# EAGLE design CSS811_CO2_TVOC_Breakout-Mill (EAGLE 7.5.0)
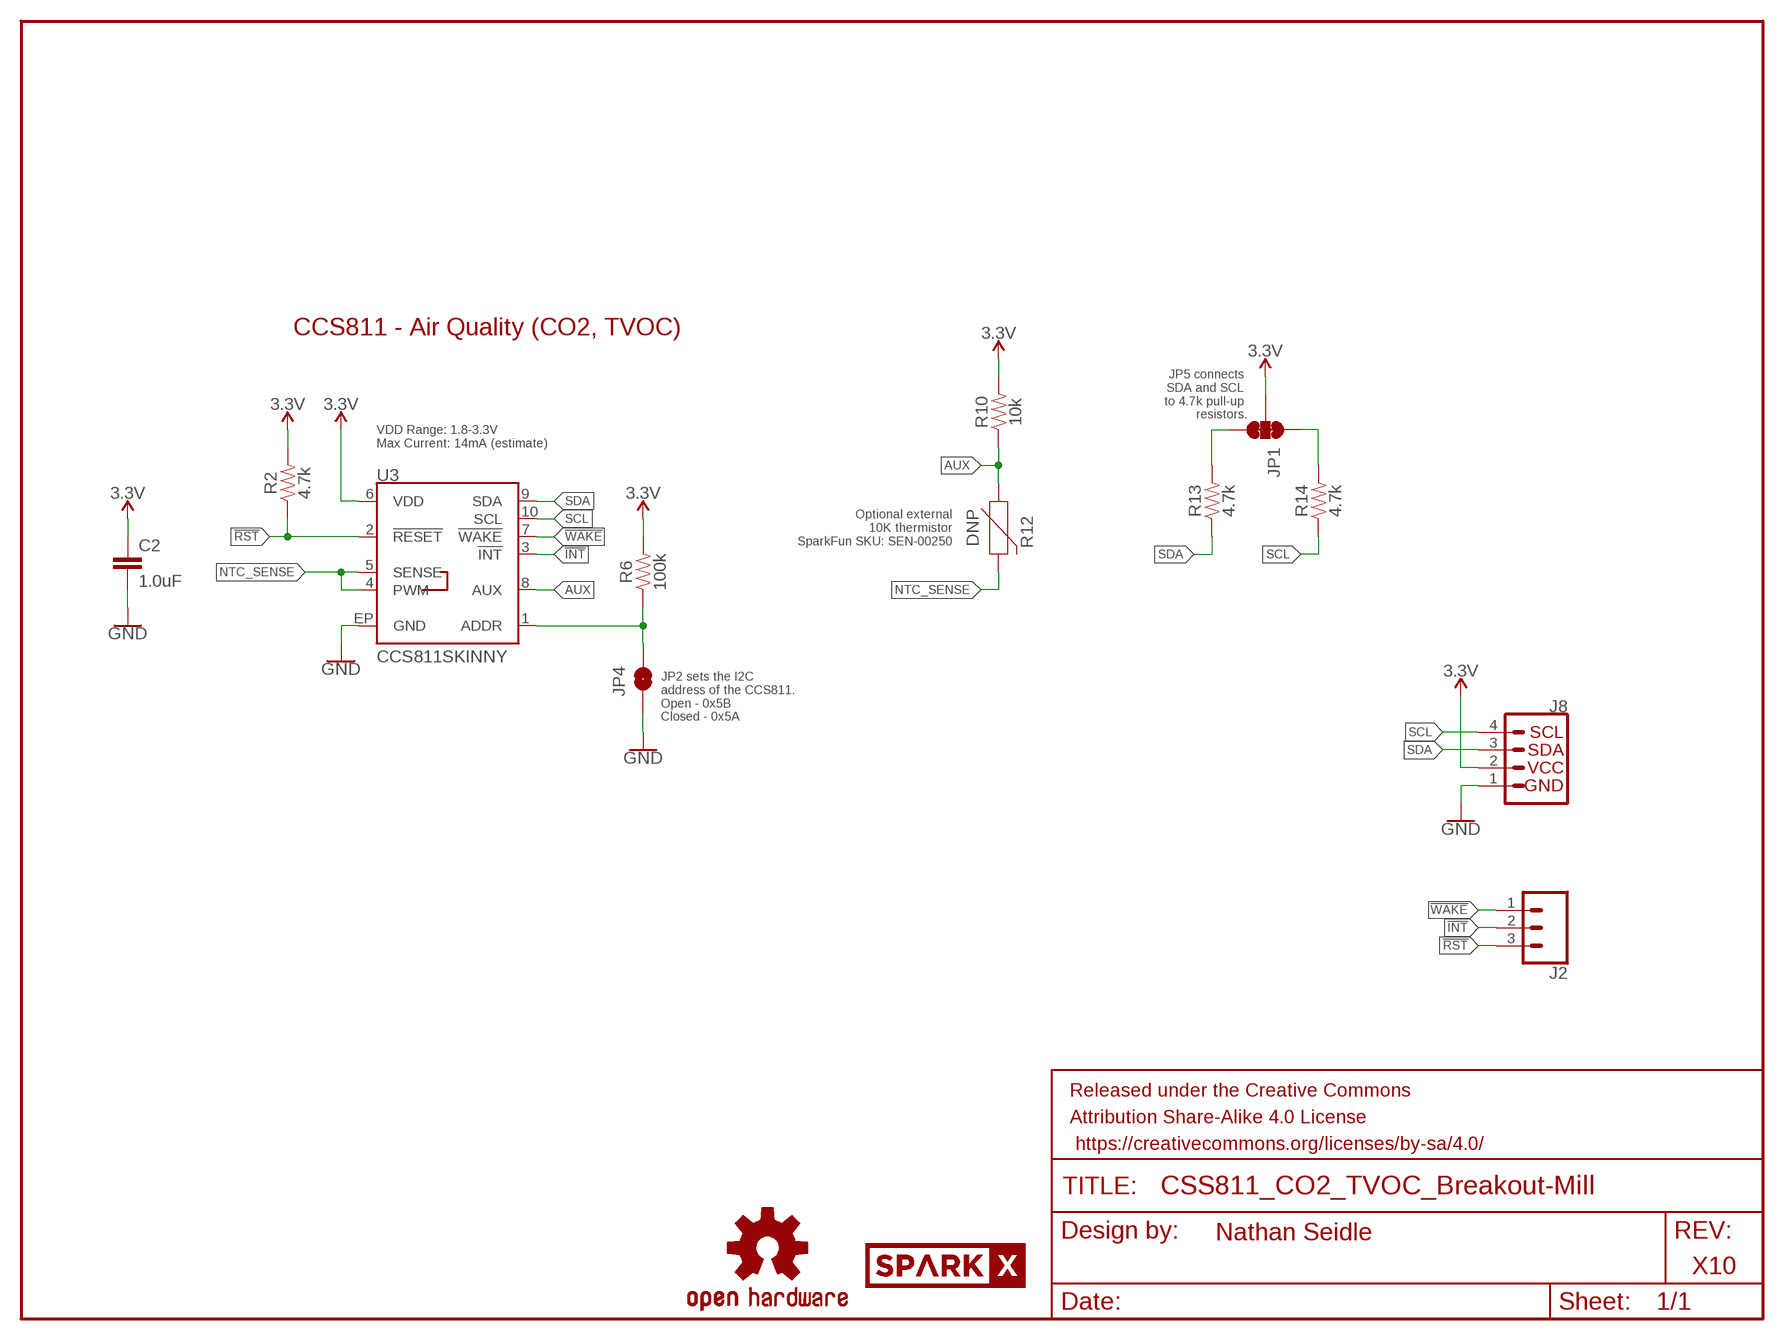
[diagram p0: schematic, sheet 1]

## Parts
C2  1.0uF  1.0UF-0603-16V-10%  [0603]
FRAME1  FRAME-LETTER  [CREATIVE_COMMONS]
J2  CONN_031X03_NO_SILK  [1X03_NO_SILK]
J8  I2C_STANDARD_NO_SILK  [1X04_NO_SILK]
JP1  JUMPER-SMT_3_2-NC_TRACE_SILK  [SMT-JUMPER_3_2-NC_TRACE_SILK]
JP4  JUMPER-SMT_2_NO_SILK  [SMT-JUMPER_2_NO_SILK]
LOGO4  OSHW-LOGOS  [OSHW-LOGO-S]
R2  4.7k  4.7KOHM-0603-1/10W-1%  [0603]
R6  100k  100KOHM-0603-1/10W-1%  [0603]
R10  10k  10KOHM-0603-1/10W-1%  [0603]
R12  DNP  NTC-THERMISTOR-AXIAL-0.1  [AXIAL-0.1]
R13  4.7k  4.7KOHM-0603-1/10W-1%  [0603]
R14  4.7k  4.7KOHM-0603-1/10W-1%  [0603]
U3  CCS811SKINNY  [LGA10-MILLABLE]
U$1  SPARKX-LOGO3  [SPARKX-SMALL]

## Nets
3.3V: C2.1 J8.2 JP1.2 R2.2 R6.2 R10.2 U3.6(VDD)
!INT: J2.2 U3.3(!INT!)
!RST: J2.3 R2.1 U3.2(!RESET!)
!WAKE: J2.1 U3.7(!WAKE!)
AUX: R10.1 R12.P$1 U3.8(AUX)
CCS811_ADDR: JP4.2 R6.1 U3.1(ADDR)
GND: C2.2 J8.1 JP4.1 U3.EP(GND)
N$4: JP1.3 R13.2
N$5: JP1.1 R14.2
NTC_SENSE: R12.P$2 U3.4(PWM) U3.5(SENSE)
SCL: J8.4 R14.1 U3.10(SCL)
SDA: J8.3 R13.1 U3.9(SDA)

## Notes on the sheet
- CCS811 - Air Quality (CO2, TVOC)
- JP5 connects 
  SDA and SCL 
  to 4.7k pull-up 
  resistors.
- VDD Range: 1.8-3.3V
  Max Current: 14mA (estimate)
- Optional external
  10K thermistor
  SparkFun SKU: SEN-00250
- JP2 sets the I2C 
  address of the CCS811.
  Open - 0x5B
  Closed - 0x5A
- Nathan Seidle
- X10

## Library data of the parts
C2 = SparkFun-Capacitors:1.0UF: 1µF ceramic capacitors A capacitor is a passive two-terminal electrical component used to store electrical energy temporarily in an electric field.; PROD_ID: CAP-00868
FRAME1 = SparkFun-Aesthetics:FRAME-LETTER: Schematic Frame - Letter Standard 8.5x11 US Letter frame
J2 = SparkFun-Connectors:CONN_03: Multi connection point. Often used as Generic Header-pin footprint for 0.1 inch spaced/style header connections On any of the 0.1 inch spaced packages, you can populate with these: Break Away Headers - Straight <https://www.sparkfun.com/products/116> (PRT-00116) Break Away Male Headers - Right Angle <https://www.sparkfun.com/products/553> (PRT-00553) Female Headers <https://www.sparkfun.com/products/115> (PRT-00115) Break Away Headers - Machine Pin <https://www.sparkfun.com/products/117> (PRT-00117) Break Away Female Headers - Swiss Machine Pin <https://www.sparkfun.com/products/743> (PRT-00743) Stackable Header - 3 Pin (Female, 0.1") <https://www.sparkfun.com/products/13875> (PRT-13875) For SCREWTERMINALS and SPRING TERMINALS visit here: Screw Terimnals on SparkFun.com <https://www.sparkfun.com/search/results?term=Screw+Terminals> (5mm/3.5mm/2.54mm spacing) This device is also useful as a general connection point to wire up your design to another part of your project. Our various solder wires solder well into these plated through hole pads. Hook-Up Wire - Assortment (Stranded, 22 AWG) <https://www.sparkfun.com/products/11375> (PRT-11375) Hook-Up Wire - Assortment (Solid Core, 22 AWG) <https://www.sparkfun.com/products/11367> (PRT-11367) View the entire wire category on our website here <https://www.sparkfun.com/categories/141> Special notes: Molex polarized connector foot print use with SKU : PRT-08232 with associated crimp pins and housings.
J8 = SparkFun-Connectors:I2C_STANDARD: SparkFun I2C Standard Pinout Header SparkFun has standardized on a pinout for all I2C based sensor breakouts. This pinout allows I2C boards to be plugged directly into the headers on Arduino Uno compatible boards, and to be daisy chained easily. Example SparkFun Products: SparkFun Atmospheric Sensor Breakout - BME280 <https://www.sparkfun.com/products/13676> SparkFun Altitude/Pressure Sensor Breakout - MPL3115A2 <https://www.sparkfun.com/products/11084> SparkFun TOF Range Finder Sensor - VL6180 <https://www.sparkfun.com/products/12785>
JP1 = SparkFun-Jumpers:JUMPER-SMT_3_2-NC_TRACE: Normally closed trace jumper (2 of 2 connections) This jumper has a trace between all three pads so they are normally closed (NC). Use a razor knife to open the connection(s). For best results follow the IPC guidelines for cutting traces: Cutout at least 0.063 mm (0.005 in). Remove all loose material to clean up the cut area. Seal the cut with an approved epoxy. Reapply solder to reclose the connection(s).
JP4 = skinny-center-pad-to-mill:JUMPER-SMT_2_NO: Normally open jumper This jumper has two pads in close proximity to each other. Apply solder to close the connection. Round pads are easier to solder for beginners, but are a lot larger. SparkFun Product that uses the round pads: SparkFun EL Sequencer <https://www.sparkfun.com/products/12781>
LOGO4 = SparkFun-Aesthetics:OSHW-LOGO: Open-Source Hardware (OSHW) Logo This logo indicates the piece of hardware it is found on incorporates a OSHW license and/or adheres to the definition of open source hardware found here: http://freedomdefined.org/OSHW
R2 R13 R14 = SparkFun-Resistors:4.7KOHM: 4.7kΩ resistor A resistor is a passive two-terminal electrical component that implements electrical resistance as a circuit element. Resistors act to reduce current flow, and, at the same time, act to lower voltage levels within circuits. - Wikipedia; PROD_ID: RES-07857
R6 = SparkFun-Resistors:100KOHM: 100kΩ resistor A resistor is a passive two-terminal electrical component that implements electrical resistance as a circuit element. Resistors act to reduce current flow, and, at the same time, act to lower voltage levels within circuits. - Wikipedia; PROD_ID: RES-07828
R10 = SparkFun-Resistors:10KOHM: 10kΩ resistor A resistor is a passive two-terminal electrical component that implements electrical resistance as a circuit element. Resistors act to reduce current flow, and, at the same time, act to lower voltage levels within circuits. - Wikipedia; PROD_ID: RES-00824
R12 = esp32-environ-monitor-temp:NTC-THERMISTOR: NTC Thermistor An NTC thermistor's resistance decreases as temperature rises. Applications: Resistance Thermometer - temperature monitoring Inrush current limiter Heat source; PROD_ID: N/A; SF_ID: SEN-00250; VALUE: 10k
U3 = SparkX:CCS811: AMS CCS811 – I2C Digital Gas Sensor Ultra-Low Power Digital Gas Sensor for Monitoring Indoor Air Quality AMS Product Page <http://ams.com/eng/Products/Environmental-Sensors/Gas-Sensors/CCS811> SparkFun Products:
U$1 = SparkX:SPARKX-LOGO

## Board
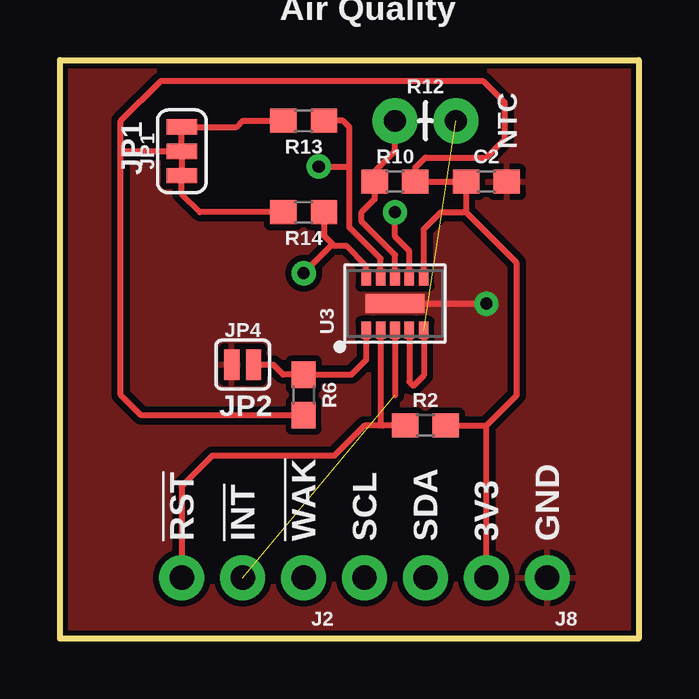
[diagram p1: board, top side]
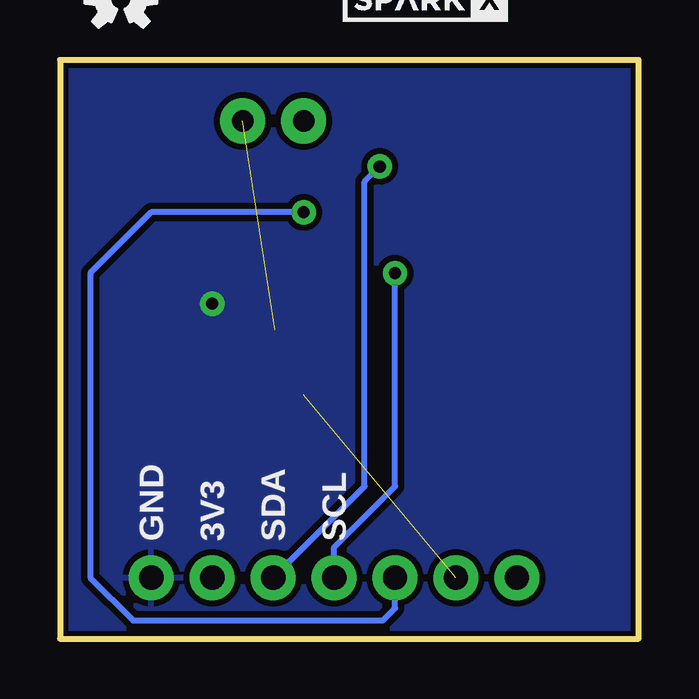
[diagram p2: board, bottom side, seen from below]

Size 24.13 x 24.13 mm. Coordinates in mm from the lower left corner, seen from the top.
Outline: 0,0 0,24.13 24.13,24.13 24.13,0 0,0
Copper layers (1*16): Top 0.035mm / dielectric 1.5mm / Bottom 0.035mm
Design rules "SparkFun-2-layer-STANDARD": minimum track width 10mil, minimum drill 20mil, track to track 10mil, track to pad 8mil, pad to pad 8mil, via to via 10mil, smd to smd 8mil, copper to edge 8mil, drill to drill 8mil, minimum pad ring 10mil, minimum via ring 10mil, stop-mask expansion 4mil, vias tented up to drill 25mil, thermal gap 10mil
Milling: area 44.5,26.7 to 55.9,34.3; area 44.5,16.5 to 55.9,24.1

### Footprints (pad centres in the part's own frame; a part is rotated, then mirrored left to right if it is on the bottom)
0603 = smd 1.1 x 1: 1 -0.85,0; 2 0.85,0
1X03_NO_SILK = drill 1.016 pad 1.88: 1 0,0; 2 2.54,0; 3 5.08,0
1X04_NO_SILK = drill 1.016 pad 1.88: 1 0,0; 2 2.54,0; 3 5.08,0; 4 7.62,0
SMT-JUMPER_3_2-NC_TRACE_SILK = smd 0.635 x 1.27: 1 -1.016,0; 2 0,0; 3 1.016,0
SMT-JUMPER_2_NO_SILK = smd 0.635 x 1.27: 1 -0.456,0; 2 0.456,0
AXIAL-0.1 = drill 0.9 pad 1.88: P$1 -1.27,0; P$2 1.27,0
LGA10-MILLABLE = smd 0.7 x 0.4: 1 -1.1,1.2; 2 -1.1,0.6; 3 -1.1,0; 4 -1.1,-0.6; 5 -1.1,-1.2; 6 1.1,-1.2; 7 1.1,-0.6; 8 1.1,0; 9 1.1,0.6; 10 1.1,1.2 | smd 0.8 x 2.45: EP 0,0

### Placement (x,y rotation side)
C2  17.78,19.05 0 top
FRAME1  -13.97,-21.59 0 top  (outside the outline)
J2  10.16,2.54 180 top
J8  20.32,2.54 180 top
JP1  5.08,20.32 90 top
JP4  7.62,11.43 0 top
LOGO4  21.59,26.67 0 bottom
R2  15.24,8.89 0 top
R6  10.16,10.16 270 top
R10  13.97,19.05 0 top
R12  15.24,21.59 0 top
R13  10.16,21.59 180 top
R14  10.16,17.78 180 top
U3  13.97,13.97 90 top
U$1  8.89,26.67 0 bottom

### Tracks (layer width: path | path; a pad name or v marks a point on that pad's centre or on a via)
3.3V
  Top 0.254: 16.93,17.78 C2.1 R10.2 14.82,19.65 15.24,20.07 17.78,20.07 18.54,20.83 18.54,22.35 17.65,23.24 4.19,23.24 2.54,21.59 2.54,20.32 | J8.2 17.78,8.89 | R2.2 17.78,8.89 | 2.54,20.32 JP1.2 | R6.2 3.39,9.31 2.54,10.16 2.54,20.32 | 17.78,8.89 19.05,10.16 19.05,15.66 16.93,17.78 | 16.93,17.78 15.88,17.78 15.17,17.07 U3.6
!INT  (1 unrouted)
  Top 0.254: U3.3 13.97,10.16
!RST
  Top 0.254: R2.1 13.46,8.89 | 13.46,8.89 13.34,8.89 | J2.3 5.08,6.35 6.35,7.62 11.43,7.62 12.7,8.89 13.34,8.89 | 13.37,8.93 13.34,8.89 | U3.2 13.37,8.98 13.46,8.89
!WAKE  (via drill 0.51)
  Top 0.254: v13.97,17.78 13.97,16.76 14.57,16.16 U3.7
  Bottom 0.254: v13.97,17.78 20.32,17.78 22.86,15.24 22.86,2.54 21.08,0.76 10.67,0.76 10.16,1.27 J2.1
AUX
  Top 0.254: R12.P$1 13.97,20.32 13.12,19.47 R10.1 13.12,18.33 12.57,17.78 12.57,17.4 13.97,16 U3.8
CCS811_ADDR
  Top 0.254: JP4.2 8.89,11.43 9.31,11.01 R6.1 12.15,11.01 12.77,11.63 U3.1
GND  (via drill 0.51)
  Top 0.254: U3.EP v17.78,13.97
  pour Top (isolate 0.178): 0,0 24.13,0 24.13,24.13 0,24.13
  pour Bottom (isolate 0.178): 0,24.13 24.13,24.13 24.13,0 0,0
N$4
  Top 0.254: JP1.3 7.37,21.34 7.62,21.59 R13.2
N$5
  Top 0.254: R14.2 5.84,17.78 5.08,18.54 JP1.1
NTC_SENSE  (1 unrouted)
  Top 0.254: U3.4 14.57,10.7 14.73,10.54 15.17,10.98 U3.5
SCL  (via drill 0.51)
  Top 0.254: R14.1 11.01,16.8 11.43,16.38 | 11.43,16.38 11.94,16.38 12.77,15.55 U3.10 | 11.43,16.38 11.3,16.38 v10.16,15.24
  Bottom 0.254: J8.4 12.7,3.81 10.16,6.35 v10.16,15.24
SDA  (via drill 0.51)
  Top 0.254: 12.06,19.68 12.06,17.14 13.37,15.84 U3.9 | 12.06,19.68 12.06,21.34 11.81,21.59 R13.1 | v10.79,19.68 12.06,19.68
  Bottom 0.254: J8.3 11.43,6.35 11.43,19.05 v10.79,19.68

### Text on the board
tPlace: Air Quality | NTC | JP1 | JP2 | !RST | !INT | !WAK | SCL | SDA | 3V3 | GND
bPlace: SCL | SDA | 3V3 | GND
Measures: Units in inches
tDocu: Jim Lindblom